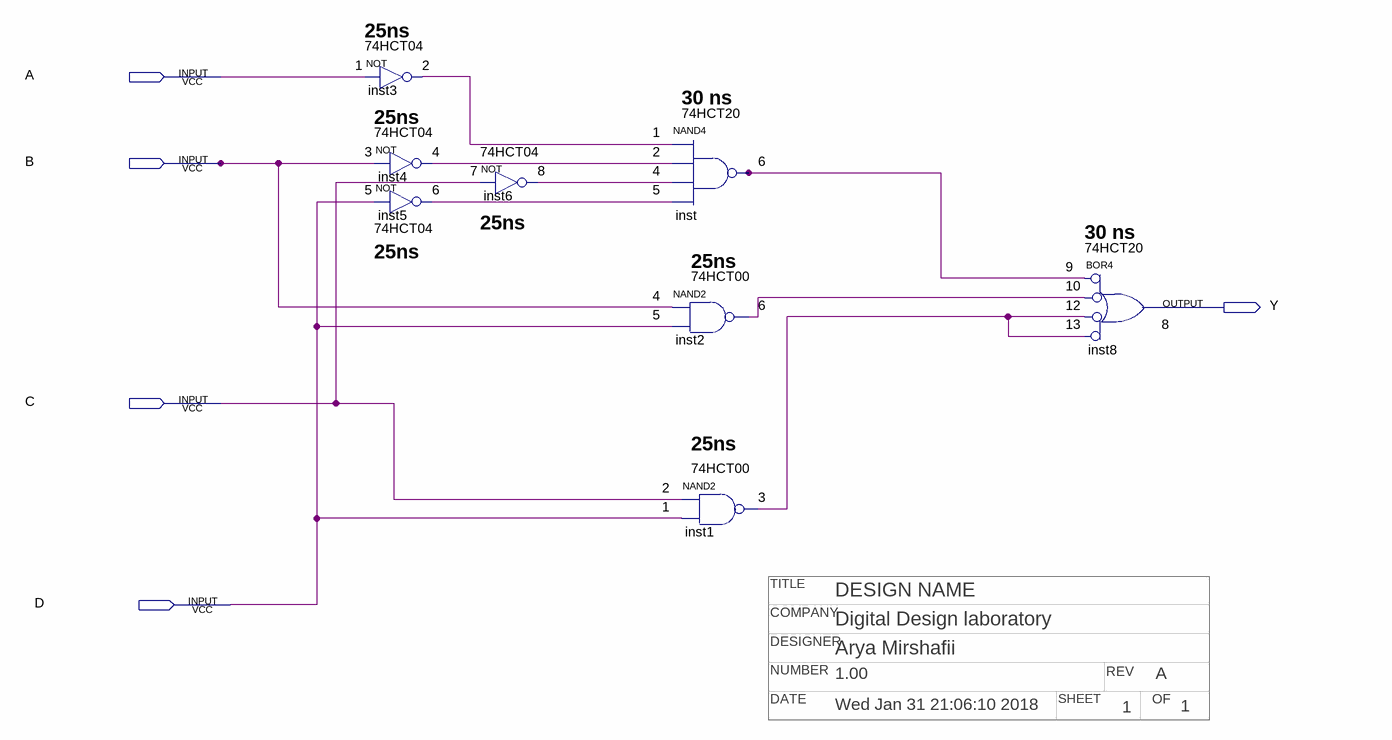
[diagram p0: schematic sheet]
// Quartus schematic lab2.bdf as structural Verilog: 8 symbols, 5 pins
// Title block: TITLE: DESIGN NAME; COMPANY: Digital Design laboratory; DESIGNER: Arya Mirshafii; NUMBER: 1.00; REV: A; DATE: Wed Jan 31 21:06:10 2018; SHEET: 1; OF: 1
module lab2 (
  input  A,
  input  B,
  input  C,
  input  D,
  output Y
);

  wire inst1_out, inst2_out, inst3_out, inst4_out, inst5_out, inst6_out, inst_out;

  not inst3 (inst3_out, A);
  not inst4 (inst4_out, B);
  not inst5 (inst5_out, D);
  not inst6 (inst6_out, C);
  nand inst (inst_out, inst3_out, inst4_out, inst6_out, inst5_out);
  nand inst2 (inst2_out, B, D);
  nand inst1 (inst1_out, C, D);
  or inst8 (Y, ~inst_out, ~inst2_out, ~inst1_out, ~inst1_out);  // BOR4

  // Notes on the sheet:
  //   25ns
  //   74HCT04
  //   1
  //   2
  //   30 ns
  //   25ns
  //   74HCT20
  //   74HCT04
  //   1
  //   3
  //   4
  //   74HCT04
  //   2
  //   6
  //   7
  //   8
  //   4
  //   5
  //   6
  //   5
  //   25ns
  //   74HCT04
  //   30 ns
  //   25ns
  //   74HCT20
  //   25ns
  //   9
  //   74HCT00
  //   10
  //   4
  //   6
  //   12
  //   5
  //   13
  //   8
  //   25ns
  //   74HCT00
  //   2
  //   3
  //   1
endmodule
